# Altium schematic sheet MP-USB.SchDoc
size A4; SheetNumber: 6; SheetTotal: 6
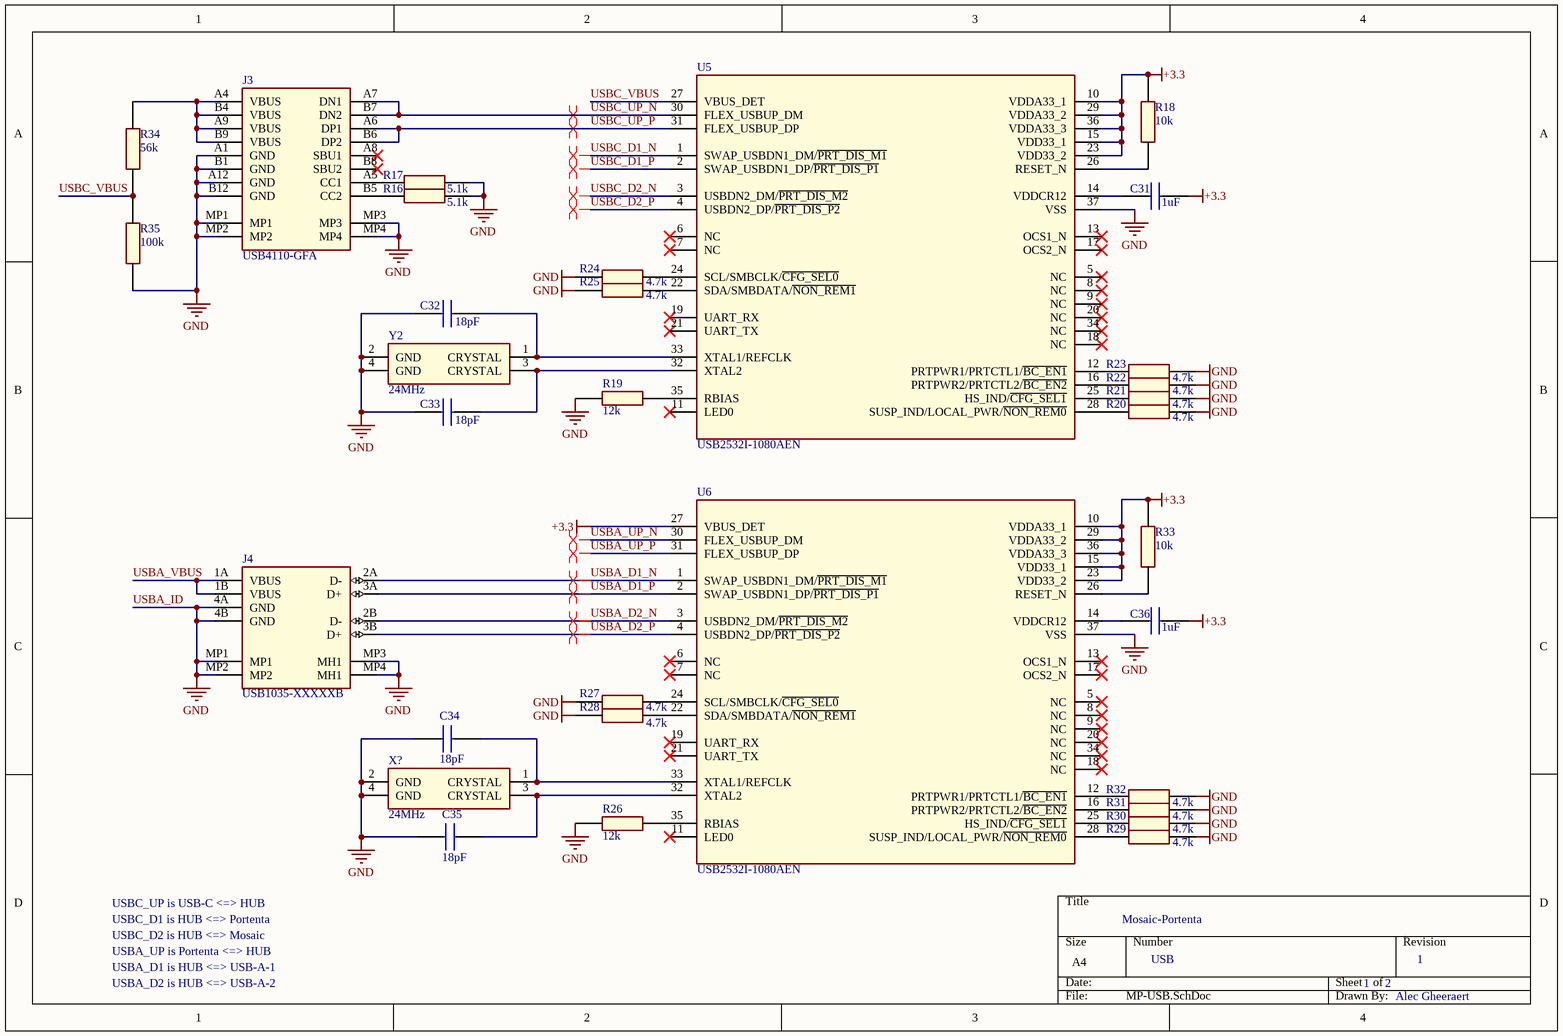
[diagram p0: MP-USB.SchDoc]

## Parts
C31  1uF  [CAPC1608X100N]
C32  18pF  [CAPC1608X87N]
C33  18pF  [CAPC1608X87N]
C34  18pF  [CAPC1608X87N]
C35  18pF  [CAPC1608X87N]
C36  1uF  [CAPC1608X100N]
J3  USB4110-GFA  [USB4110-GFA]
J4  USB1035-XXXXXB  [USB1035-XXXXXB]
R16  5.1k  [RESC1608X60N]
R17  5.1k  [RESC1608X60N]
R18  10k  [RESC1005X40N]
R19  12k  [RESC1005X40N]
R20  4.7k  [RESC1005X40N]
R21  4.7k  [RESC1005X40N]
R22  4.7k  [RESC1005X40N]
R23  4.7k  [RESC1005X40N]
R24  4.7k  [RESC1005X40N]
R25  4.7k  [RESC1005X40N]
R26  12k  [RESC1005X40N]
R27  4.7k  [RESC1005X40N]
R28  4.7k  [RESC1005X40N]
R29  4.7k  [RESC1005X40N]
R30  4.7k  [RESC1005X40N]
R31  4.7k  [RESC1005X40N]
R32  4.7k  [RESC1005X40N]
R33  10k  [RESC1005X40N]
R34  56k  [RESC1005X40N]
R35  100k  [RESC1005X40N]
U5  USB2532I-1080AEN  [QFN50P600X600X100-37N-D]
U6  USB2532I-1080AEN  [QFN50P600X600X100-37N-D]
X?  24MHz  [LFXTAL071257Reel]
Y2  24MHz  [LFXTAL071257Reel]

## Nets
+3.3: C31.2 C36.2 R18.2 R33.2 U5.10(VDDA33_1) U5.15(VDD33_1) U5.23(VDD33_2) U5.29(VDDA33_2) U5.36(VDDA33_3) U6.10(VDDA33_1) U6.15(VDD33_1) U6.23(VDD33_2) U6.27(VBUS_DET) U6.29(VDDA33_2) U6.36(VDDA33_3)
USBA_ID: C32.1 C33.1 C34.2 C35.2 J3.A1(GND) J3.A12(GND) J3.B1(GND) J3.B12(GND) J3.MP1 J3.MP2 J3.MP3 J3.MP4 J4.4A(GND) J4.4B(GND) J4.MP1 J4.MP2 J4.MP3(MH1) J4.MP4(MH1) R16.2 R17.2 R19.2 R20.2 R21.2 R22.2 R23.2 R24.1 R25.1 R26.2 R27.2 R28.2 R29.2 R30.2 R31.2 R32.2 R35.2 U5.37(VSS) U6.37(VSS) X?.2(GND) X?.4(GND) Y2.2(GND) Y2.4(GND)  [also labelled GND]
USBA_D1_N: J4.2A(D-) U6.1(SWAP_USBDN1_DM/~{PRT_DIS_M1})
USBA_D1_P: J4.3A(D+) U6.2(SWAP_USBDN1_DP/~{PRT_DIS_P1})
USBA_D2_N: J4.2B(D-) U6.3(USBDN2_DM/~{PRT_DIS_M2})
USBA_D2_P: J4.3B(D+) U6.4(USBDN2_DP/~{PRT_DIS_P2})
USBA_UP_N: U6.30(FLEX_USBUP_DM)
USBA_UP_P: U6.31(FLEX_USBUP_DP)
USBA_VBUS: J4.1A(VBUS) J4.1B(VBUS)
USBC_D1_N: U5.1(SWAP_USBDN1_DM/~{PRT_DIS_M1})
USBC_D1_P: U5.2(SWAP_USBDN1_DP/~{PRT_DIS_P1})
USBC_D2_N: U5.3(USBDN2_DM/~{PRT_DIS_M2})
USBC_D2_P: U5.4(USBDN2_DP/~{PRT_DIS_P2})
USBC_UP_N: J3.A7(DN1) J3.B7(DN2) U5.30(FLEX_USBUP_DM)
USBC_UP_P: J3.A6(DP1) J3.B6(DP2) U5.31(FLEX_USBUP_DP)
USBC_VBUS: R34.2 R35.1 U5.27(VBUS_DET)
NetC31_1: C31.1 U5.14(VDDCR12)
NetC32_2: C32.2 U5.33(XTAL1/REFCLK) Y2.1(CRYSTAL)
NetC33_2: C33.2 U5.32(XTAL2) Y2.3(CRYSTAL)
NetC34_1: C34.1 U6.33(XTAL1/REFCLK) X?.1(CRYSTAL)
NetC35_1: C35.1 U6.32(XTAL2) X?.3(CRYSTAL)
NetC36_1: C36.1 U6.14(VDDCR12)
NetJ3_A4: J3.A4(VBUS) J3.A9(VBUS) J3.B4(VBUS) J3.B9(VBUS) R34.1
NetJ3_A5: J3.A5(CC1) R17.1
NetJ3_B5: J3.B5(CC2) R16.1
NetR18_1: R18.1 U5.26(RESET_N)
NetR19_1: R19.1 U5.35(RBIAS)
NetR20_1: R20.1 U5.28(SUSP_IND/LOCAL_PWR/~{NON_REM0})
NetR21_1: R21.1 U5.25(HS_IND/~{CFG_SEL1})
NetR22_1: R22.1 U5.16(PRTPWR2/PRTCTL2/~{BC_EN2})
NetR23_1: R23.1 U5.12(PRTPWR1/PRTCTL1/~{BC_EN1})
NetR24_2: R24.2 U5.24(SCL/SMBCLK/~{CFG_SEL0})
NetR25_2: R25.2 U5.22(SDA/SMBDATA/~{NON_REM1})
NetR26_1: R26.1 U6.35(RBIAS)
NetR27_1: R27.1 U6.24(SCL/SMBCLK/~{CFG_SEL0})
NetR28_1: R28.1 U6.22(SDA/SMBDATA/~{NON_REM1})
NetR29_1: R29.1 U6.28(SUSP_IND/LOCAL_PWR/~{NON_REM0})
NetR30_1: R30.1 U6.25(HS_IND/~{CFG_SEL1})
NetR31_1: R31.1 U6.16(PRTPWR2/PRTCTL2/~{BC_EN2})
NetR32_1: R32.1 U6.12(PRTPWR1/PRTCTL1/~{BC_EN1})
NetR33_1: R33.1 U6.26(RESET_N)

Not connected (* = marked no-connect by the designer): J3 A8(SBU1)* B8(SBU2)*; U5 5(NC)* 6(NC)* 7(NC)* 8(NC)* 9(NC)* 11(LED0)* 13(OCS1_N)* 17(OCS2_N)* 18(NC)* 19(UART_RX)* 20(NC)* 21(UART_TX)* 34(NC)*; U6 5(NC)* 6(NC)* 7(NC)* 8(NC)* 9(NC)* 11(LED0)* 13(OCS1_N)* 17(OCS2_N)* 18(NC)* 19(UART_RX)* 20(NC)* 21(UART_TX)* 34(NC)*

## Layout directives
differential pair: USBA_D1_N, USBA_D1_P, USBA_D2_N, USBA_D2_P, USBA_UP_N, USBA_UP_P, USBC_D1_N, USBC_D1_P, USBC_D2_N, USBC_D2_P, USBC_UP_N, USBC_UP_P

## Notes on the sheet
- USBC_UP is USB-C <=> HUB
- USBC_D1 is HUB <=> Portenta
- Mosaic-Portenta
- USBC_D2 is HUB <=> Mosaic
- USBA_UP is Portenta <=> HUB
- USBA_D1 is HUB <=> USB-A-1
- USBA_D2 is HUB <=> USB-A-2
- USB
- 1
- 2
- Alec Gheeraert

## Library data of the parts
C31 C36 = CMP-00064-1: 0603 1µF; Manufacturer: Walsin; Tolerance: 10%; Dielectric: X5R; Voltage Rating: 6.3V; Package: 0603; Min Operating Temperature: -55; Max Operating Temperature: 85; Capacitance: 1µF
C32-C35 = CMP-00052-2: 0603 18pF; Manufacturer: Walsin; Dielectric: C0G; Tolerance: 5%; Voltage Rating: 16V; Max Operating Temperature: 125; Package: 0603; Min Operating Temperature: -55; Capacitance: 18pF
J3 = CMP-00039-5: USB-2.0 Type C; Manufacturer: Global Connector Technologies; Mounting Angle: Right; Current Rating: 5A; Voltage Rating: 48V; Gender: Female; Standard: 2.0; USB Type: C; Mounting Style: Top Mount
J4 = CMP-00038-9: USB-2.0 Type A Dual; Manufacturer: Global Connector Technologies; Current Rating: 1.8A; Gender: Female; Voltage Rating: 30V; Mounting Angle: Right; USB Type: A; Standard: 2.0; Mounting Style: PCB Mount
R16 R17 = CMP-00065-3: 0603I 5.1k; Manufacturer: Walsin; Voltage Rating: 50V; Qualification: AEC-Q200; Tolerance: 1%; Power Rating: 62.5mW; Min Operating Temperature: -55; Package: 0603; Max Operating Temperature: 155; Resistance: 5.1k
R18 R33 = CMP-00026-5: 0402I 10k; Manufacturer: Walsin; Qualification: AEC-Q200; Tolerance: 1%; Voltage Rating: 50V; Power Rating: 62.5mW; Max Operating Temperature: 155; Resistance: 10k; Package: 0402; Min Operating Temperature: -55
R19 R26 = CMP-00068-1: 0402I 12k; Manufacturer: Walsin; Power Rating: 62.5mW; Tolerance: 1%; Qualification: AEC-Q200; Voltage Rating: 50V; Max Operating Temperature: 155; Resistance: 12k; Package: 0402; Min Operating Temperature: -55
R20-R25 R27-R32 = CMP-00030-4: 0402I 4.7k; Manufacturer: Walsin; Power Rating: 62.5mW; Qualification: AEC-Q200; Voltage Rating: 50V; Tolerance: 1%; Max Operating Temperature: 155; Package: 0402; Min Operating Temperature: -55; Resistance: 4.7k
R34 = CMP-00075-1: 0402I 56k; Manufacturer: Walsin; Tolerance: 1%; Qualification: AEC-Q200; Voltage Rating: 50V; Power Rating: 62.5mW; Package: 0402; Resistance: 56k; Min Operating Temperature: -55; Max Operating Temperature: 155
R35 = CMP-00029-4: 0402I 100k; Manufacturer: Walsin; Voltage Rating: 50V; Power Rating: 62.5mW; Qualification: AEC-Q200; Tolerance: 1%; Package: 0402; Resistance: 100k; Max Operating Temperature: 155; Min Operating Temperature: -55
U5 U6 = CMP-00071-2: 2-Port USB-2.0 Controller Hub; Manufacturer: Microchip; Ports: 2; Data Rate: 480Mb/s; Package: SQFN-36; Standard: USB 2.0
X? Y2 = CMP-00067-2: 24MHz +/-100ppm Crystal; Manufacturer: IQD; Qualification: AEC-Q200; Tolerance: 10; Drive Level: 100µW; ESR: 100; Load Capacitance: 10pF; Min Operating Temperature: -40; Package: 2mm x 1.6mm; Frequency: 24MHz; Max Operating Temperature: 125